# Altium schematic sheet main.SchDoc
size A4; SheetNumber: 1; SheetTotal: 1
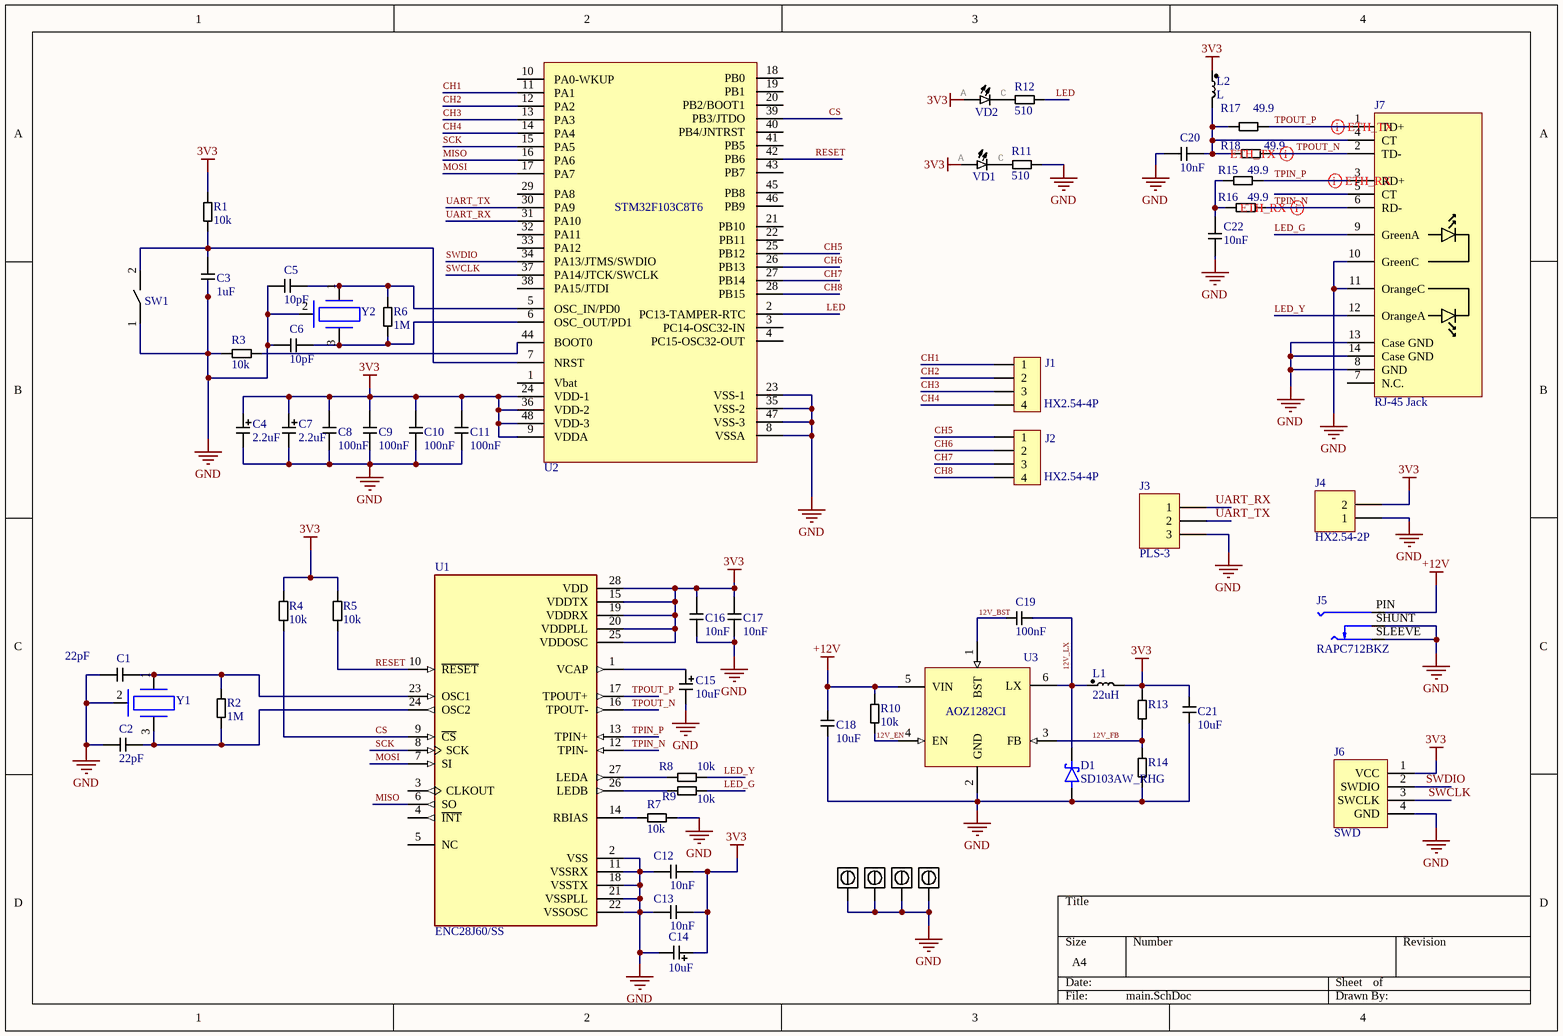
[diagram p0: main.SchDoc]

## Parts
1  SMTSO_STAND_M3  [M3x1]  (value not drawn)
2  SMTSO_STAND_M3  [M3x1]  (value not drawn)
3  SMTSO_STAND_M3  [M3x1]  (value not drawn)
4  SMTSO_STAND_M3  [M3x1]  (value not drawn)
C1  22pF  [0805_MD_CAPC2012X05N]
C2  22pF  [0805_MD_CAPC2012X05N]
C3  1uF  [0805_MD_CAPC2012X05N]
C4  2.2uF  [6.3x5.4_HD_CAPAE7266X54L]
C5  10pF  [0805_MD_CAPC2012X05N]
C6  10pF  [0805_MD_CAPC2012X05N]
C7  2.2uF  [6.3x5.4_HD_CAPAE7266X54L]
C8  100nF  [0805_MD_CAPC2012X05N]
C9  100nF  [0805_MD_CAPC2012X05N]
C10  100nF  [0805_MD_CAPC2012X05N]
C11  100nF  [0805_MD_CAPC2012X05N]
C12  10nF  [0805_MD_CAPC2012X05N]
C13  10nF  [0805_MD_CAPC2012X05N]
C14  10uF  [6.3x5.4_HD_CAPAE7266X54L]
C15  10uF  [6.3x5.4_HD_CAPAE7266X54L]
C16  10nF  [0805_MD_CAPC2012X05N]
C17  10nF  [0805_MD_CAPC2012X05N]
C18  10uF  [0805_MD_CAPC2012X05N]
C19  100nF  [0805_MD_CAPC2012X05N]
C20  10nF  [0805_MD_CAPC2012X05N]
C21  10uF  [0805_MD_CAPC2012X05N]
C22  10nF  [0805_MD_CAPC2012X05N]
D1  SD103AW_RHG  [DIO_SD103AW_RHG]
J1  HX2.54-4P  [JST_S4B-XH-A(LF)(SN)]
J2  HX2.54-4P  [JST_S4B-XH-A(LF)(SN)]
J3  PLS-3  [PLS-1-3]
J4  HX2.54-2P  [JST_S2B-XH-A(LF)(SN)]
J5  RAPC712BKZ  [SWITCHCRAFT_RAPC712BKZ]
J6  SWD  [SWD-4]
J7  RJ-45 Jack  [J011D21BNL]
L1  22uH  [LQH32P_MD_INDP3225X17N]
L2  L  [0603_LD_RESC1608X06M]
R1  10k  [0805_MD_RESC2012X06N]
R2  1M  [0805_MD_RESC2012X06N]
R3  10k  [0805_MD_RESC2012X06N]
R4  10k  [0805_MD_RESC2012X06N]
R5  10k  [0805_MD_RESC2012X06N]
R6  1M  [0805_MD_RESC2012X06N]
R7  10k  [0805_MD_RESC2012X06N]
R8  10k  [0805_MD_RESC2012X06N]
R9  10k  [0805_MD_RESC2012X06N]
R10  10k  [0805_MD_RESC2012X06N]
R11  510  [0805_MD_RESC2012X06N]
R12  510  [0805_MD_RESC2012X06N]
R13  (no value)  [0805_MD_RESC2012X06N]
R14  (no value)  [0805_MD_RESC2012X06N]
R15  49.9  [0805_MD_RESC2012X06N]
R16  49.9  [0805_MD_RESC2012X06N]
R17  49.9  [0805_MD_RESC2012X06N]
R18  49.9  [0805_MD_RESC2012X06N]
SW1  LL3301  [LL3301]  (value not drawn)
U1  ENC28J60/SS  [SOP65P780X200-28N]
U2  GD32F103C8T6  [QFP48_MD_TSQFP50P900X900X120-48N]  (value not drawn)
U3  AOZ1282CI  [SOT23_6_MD_SOT95P280X125-6N]  (value not drawn)
VD1  LED  [LEDSC125X200X90-2N]  (value not drawn)
VD2  LED  [LED_APT2012MGC]  (value not drawn)
Y1  3225  [YANGXING_SMD_3225_4L]  (value not drawn)
Y2  X32258MOB4SI  [YANGXING_SMD_3225_4L]  (value not drawn)

## Nets
3V3: C4.1 C7.1 C8.1 C9.1 C10.1 C11.1 C12.2 C13.2 C14.1 C16.1 C17.1 C21.1 J4.2 J6.1(VCC) L1.2 L2.1 R1.2 R4.2 R5.2 R13.2 U1.15(VDDTX) U1.19(VDDRX) U1.20(VDDPLL) U1.25(VDDOSC) U1.28(VDD) U2.9(VDDA) U2.24(VDD-1) U2.36(VDD-2) U2.48(VDD-3) VD1.A VD2.A
+12V: C18.1 J5.PIN R10.2 U3.5(VIN)
GND: 1.1 2.1 3.1 4.1 C1.1 C2.1 C3.2 C4.2 C5.1 C6.1 C7.2 C8.2 C9.2 C10.2 C11.2 C12.1 C13.1 C14.2 C15.2 C16.2 C17.2 C18.2 C20.2 C21.2 C22.2 D1.A J3.3 J4.1 J5.SHUNT J5.SLEEVE J6.4(GND) J7.8(GND) J7.10(GreenC) J7.11(OrangeC) J7.13(Case_GND) J7.14(Case_GND) R3.1 R7.1 R11.2 R14.1 SW1.1 U1.2(VSS) U1.11(VSSRX) U1.18(VSSTX) U1.21(VSSPLL) U1.22(VSSOSC) U2.8(VSSA) U2.23(VSS-1) U2.35(VSS-2) U2.47(VSS-3) U3.2(GND) Y1.2(GND) Y2.2(GND)
12V_BST: C19.1 U3.1(BST)
12V_EN: R10.1 U3.4(EN)
12V_FB: R13.1 R14.2 U3.3(FB)
12V_LX: C19.2 D1.C(K) L1.1 U3.6(LX)
CH1: J1.1 U2.11(PA1)
CH2: J1.2 U2.12(PA2)
CH3: J1.3 U2.13(PA3)
CH4: J1.4 U2.14(PA4)
CH5: J2.1 U2.25(PB12)
CH6: J2.2 U2.26(PB13)
CH7: J2.3 U2.27(PB14)
CH8: J2.4 U2.28(PB15)
CS: R4.1 U1.9(~{CS}) U2.39(PB3/JTDO)
LED: R12.2 U2.2(PC13-TAMPER-RTC)
LED_G: J7.9(GreenA) R9.1
LED_Y: J7.12(OrangeA) R8.1
MISO: U1.6(SO) U2.16(PA6)
MOSI: U1.7(SI) U2.17(PA7)
RESET: R5.1 U1.10(~{RESET}) U2.42(PB6)
SCK: U1.8(SCK) U2.15(PA5)
SWCLK: J6.3(SWCLK) U2.37(PA14/JTCK/SWCLK)
SWDIO: J6.2(SWDIO) U2.34(PA13/JTMS/SWDIO)
TPIN_N: J7.6(RD-) R16.1 U1.12(TPIN-)
TPIN_P: J7.3(RD+) R15.1 U1.13(TPIN+)
TPOUT_N: J7.2(TD-) R18.1 U1.16(TPOUT-)
TPOUT_P: J7.1(TD+) R17.1 U1.17(TPOUT+)
UART_RX: J3.1 U2.31(PA10)
UART_TX: J3.2 U2.30(PA9)
NetC1_2: C1.2 R2.2 U1.23(OSC1) Y1.1(IN)
NetC2_2: C2.2 R2.1 U1.24(OSC2) Y1.3(OUT)
NetC3_1: C3.1 R1.1 SW1.2 U2.7(NRST)
NetC5_2: C5.2 R6.2 U2.5(OSC_IN/PD0) Y2.1(IN)
NetC6_2: C6.2 R6.1 U2.6(OSC_OUT/PD1) Y2.3(OUT)
NetC15_1: C15.1 U1.1(VCAP)
NetC20_1: C20.1 J7.4(CT) L2.2 R17.2 R18.2
NetC22_1: C22.1 R15.2 R16.2
NetR3_2: R3.2 U2.44(BOOT0)
NetR7_2: R7.2 U1.14(RBIAS)
NetR8_2: R8.2 U1.27(LEDA)
NetR9_2: R9.2 U1.26(LEDB)
NetR11_1: R11.1 VD1.C
NetR12_1: R12.1 VD2.C

Not connected (* = marked no-connect by the designer): J7 5(CT) 7(N.C.); U1 3(CLKOUT) 4(~{INT}) 5(NC); U2 1(Vbat) 3(PC14-OSC32-IN) 4(PC15-OSC32-OUT) 10(PA0-WKUP) 18(PB0) 19(PB1) 20(PB2/BOOT1) 21(PB10) 22(PB11) 29(PA8) 32(PA11) 33(PA12) 38(PA15/JTDI) 40(PB4/JNTRST) 41(PB5) 43(PB7) 45(PB8) 46(PB9)

## Layout directives
differential pair; net class Ethernet; differential pair class ETH_TX_IO_LINES; rule Differential Pairs Routing [Pref Gap = 0.127mm    Min Gap  = 0.127mm    Max Gap  = 0.127mmPref Width = 0.17mm    Min Width  = 0.17mm    Max Width  = 0.17mm]: TPOUT_N, TPOUT_P
differential pair; net class Ethernet; differential pair class ETH_RX_IO_LINES: TPIN_N, TPIN_P

## Library data of the parts
1-4 = SMTSO_STAND_M3: GateName_1: PART_1; SymbolName_1: SMTSO_STAND_M3; LibraryName: SMTSO; DeviceSetName: SMTSO_STAND_M3; Package: SMTJ_stand_m3_NEW; CompCode: *
C1 C2 C5 C6 = C: Capacitor; CompCode: 1353
C3 = C: Capacitor; CompCode: 909
C4 C7 C14 C15 = CP: Capacitors IPC; CompCode: *
C8-C13 C16 C17 C20 C22 = C: Capacitor; CompCode: 6294
C18 C19 C21 = C: Capacitors IPC; CompCode: *
J1 J2 = HX2.54-4P: JST HX 2.54 4P; CompCode: 1615
J3 = PLS-3: CompCode: 2145
J4 = HX2.54-2P: JST HX 2.54 2P; CompCode: 395
J5 = RAPC712BKZ: Power Barrel Connector Jack 2.50mm ID (0.098), 5.50mm OD (0.217) Through Hole, Right Angle; MF: Switchcraft Conxall; Package: None; Price: None; Check_prices: https://www.snapeda.com/parts/RAPC712BKZ/Conxall%252FSwitchcraft/view-part/?ref=eda; Value: *; SnapEDA_Link: https://www.snapeda.com/parts/RAPC712BKZ/Conxall%252FSwitchcraft/view-part/?ref=snap; MP: RAPC712BKZ; Availability: In Stock; Purchase-URL: https://pricing.snapeda.com/search?q=RAPC712BKZ&ref=eda
J6 = SWD_4: SWD connector; CompCode: 6025
J7 = RJ-45 Jack: Ethernet jack; CompCode: *
L1 L2 = L: Inductor IPC; CompCode: *
R1 R3 R11 R12 = R: Resistor; CompCode: 652
R2 R6 = R: Resistor; CompCode: 1100
R4 R5 R7-R10 R13-R18 = R: Resistors IPC; CompCode: *
SW1 = LL3301: GateName_1: PART_1; SymbolName_1: SOFT_BUTTON_SMD_6X6; CompCode: 4234; LibraryName: Buttons; DeviceSetName: SOFT_BUTTON_SMD_6X6; Package: Soft_smd_6x6
U1 = ENC28J60/SS: 28 Pin, 8 KB RAM, MAC&PHY, Ethernet Controller | Microchip Technology Inc. ENC28J60/SS; SnapEDA_Link: https://www.snapeda.com/parts/ENC28J60/SS/Microchip/view-part/?ref=snap; Package: SSOP-28 Microchip; Value: *; MF: Microchip; MP: ENC28J60/SS; Check_prices: https://www.snapeda.com/parts/ENC28J60/SS/Microchip/view-part/?ref=eda
U2 = STM32F103C8T6: The STM32F103xx performance line family incorporates the high-performance ARM / Cortex-M3 32-bit RISC core operating at a 72 MHz frequency, high-speed embedded / memories (Flash memory up to 128Kbytes and SRAM up to 20 Kbytes), and an extensive / range of enhanced I/Os and peripherals connected to two APB buses. All devices offer two / 12-bit ADCs, three general purpose 16-bit timers plus one PWM timer, as well as standard / and advanced communication interfaces: up to two I2Cs and SPIs, three USARTs, an USB / and a CAN. / The STM32F103xx performance line family operates in the −40 to +105 °C temperature / range, from a 2.0 to 3.6 V power supply. A comprehensive set of power-saving mode allows / to design low-power applications. / The complete STM32F103xx performance line family includes devices in 5 different / package types: from 36 pins to 100 pins. Depending on the device chosen, different sets of / peripherals are included, the description below gives an overview of the complete range of / peripherals proposed in this family.; GateName_1: PART_1; CompCode: 2993; SymbolName_1: GD32F103C8T6; LibraryName: MCU; DeviceSetName: STM32F103C8T6; Package: LQFP48_7x7; Datasheet: Q:/Software/Altium/Datasheets/STM32F103C8T6.pdf
U3 = AOZ1282CI: EZBuck™ 1.2A Simple Buck Regulator. Fixed 450kHz PWM operation, 4.5V to 36V operating input voltage range; MANUFACTURER: Alpha & Omega; GateName_1: PART_1; SymbolName_1: AOZ1280CI; CompCode: 6619; LibraryName: DC-DC IC; DeviceSetName: AOZ1282CI; Package: SOT23-6P95_270X145L35X35L; DATASHEET: Q:\Software\Altium\Datasheets\AOZ1282CI.pdf
VD1 VD2 = LED: GateName_1: PART_1; SymbolName_1: LED_1204_R/A; DeviceSetName: LED_3MM_DIP_BLUE; LibraryName: LED; Package: LED_3mm_DIP_Blue; CompCode: *
Y1 = 3225: GateName_1: PART_1; SymbolName_1: AV08000301; LibraryName: Crystal Oscillator; DeviceSetName: AV08000301; Package: YANGXING_SMD_3225_4L; CompCode: *
Y2 = 3225: Резонатор кварцевый 8MHz, ±10ppm... ±30ppm, 12пФ, SMD3225, -40...+85C; GateName_1: PART_1; SymbolName_1: AV08000301; CompCode: 7637; LibraryName: Crystal Oscillator; DeviceSetName: AV08000301; Package: YANGXING_SMD_3225_4L
D1 = SD103AW_RHG: Package: None; Price: None; Value: *; MP: SD103AW_RHG; Availability: Unavailable